# EAGLE schematic Scope (EAGLE 7.1.0)
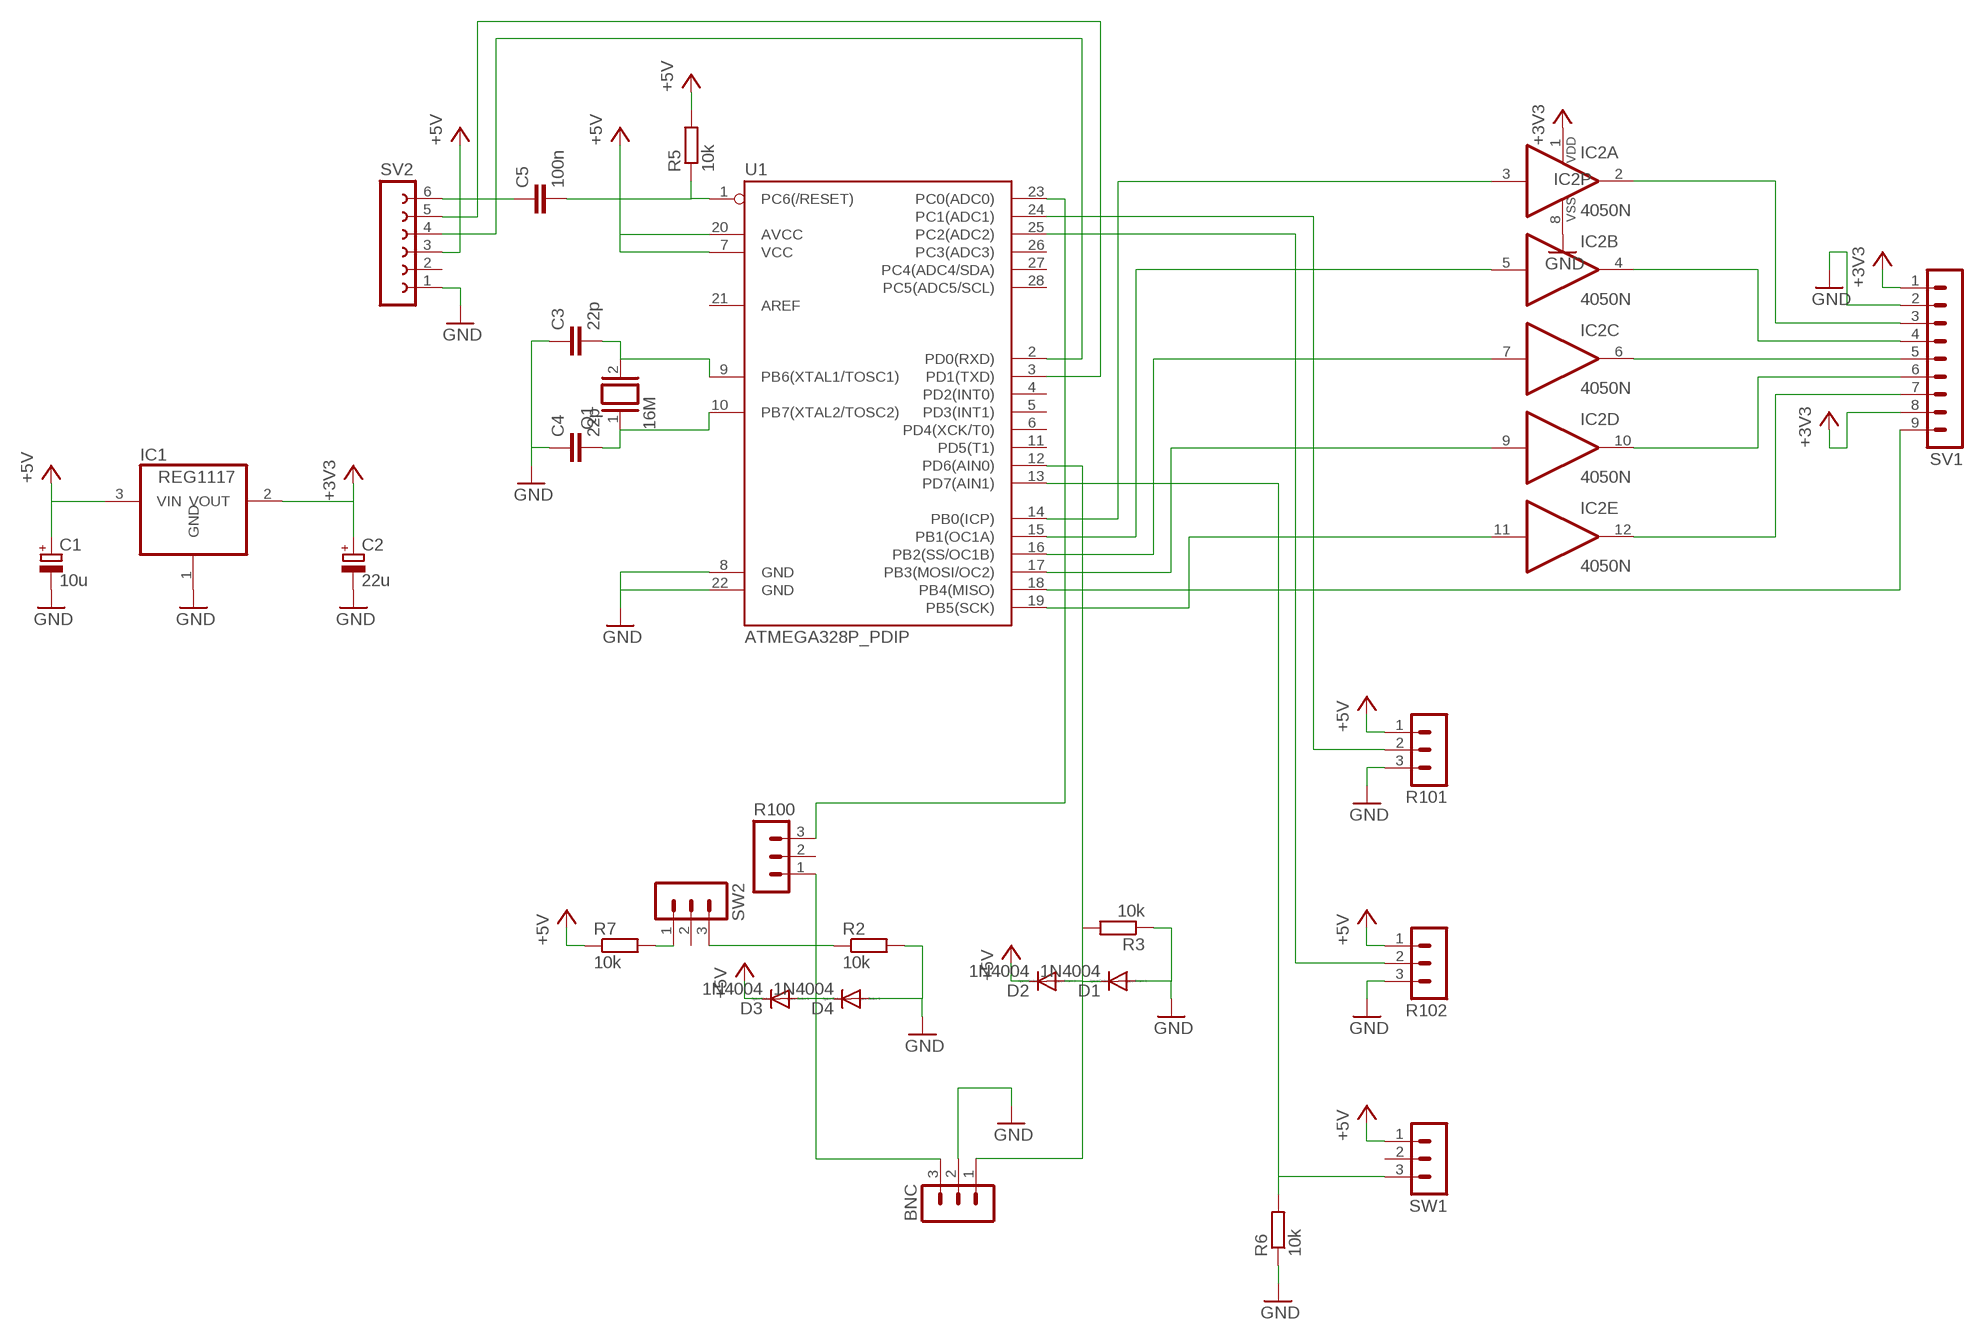
[diagram p0: schematic, sheet 1]

## Parts
BNC  MA03-1  [MA03-1]
C1  10u  CPOL-EUE2,5-6E  [E2,5-6E]
C2  22u  CPOL-EUE2,5-6E  [E2,5-6E]
C3  22p  C-EU050-024X044  [C050-024X044]
C4  22p  C-EU050-024X044  [C050-024X044]
C5  100n  C-EU050-024X044  [C050-024X044]
D1  1N4004  [DO41-10]
D2  1N4004  [DO41-10]
D3  1N4004  [DO41-10]
D4  1N4004  [DO41-10]
IC1  REG1117  [SOT223]
IC2  4050N  [DIL16]
Q1  16M  XTAL/S  [QS]
R2  10k  R-EU_0204/7  [0204/7]
R3  10k  R-EU_0204/7  [0204/7]
R5  10k  R-EU_0204/7  [0204/7]
R6  10k  R-EU_0204/7  [0204/7]
R7  10k  R-EU_0204/7  [0204/7]
R100  MA03-1  [MA03-1]
R101  MA03-1  [MA03-1]
R102  MA03-1  [MA03-1]
SV1  MA09-1  [MA09-1]
SV2  FE06-1  [FE06]
SW1  MA03-1  [MA03-1]
SW2  MA03-1  [MA03-1]
U1  ATMEGA328P_PDIP  [DIL28-3]

## Nets
+3V3: C2.+ IC1.2(VOUT) IC2.1(P:VDD) SV1.1 SV1.8
+5V: D2.C D3.C R7.1 R101.1 R102.1 SW1.1
GND: BNC.2 C1.- C2.- C3.1 C4.1 D1.A D4.A IC1.1(GND) IC2.8(P:VSS) R2.2 R3.1 R6.1 R101.3 R102.3 SV1.2 SV2.1 U1.8(GND) U1.22(GND)
N$1: IC2.11(E:I) U1.19(PB5(SCK))
N$2: IC2.9(D:I) U1.17(PB3(MOSI/OC2))
N$3: IC2.7(C:I) U1.16(PB2(SS/OC1B))
N$4: IC2.5(B:I) U1.15(PB1(OC1A))
N$5: IC2.3(A:I) U1.14(PB0(ICP))
N$6: BNC.1 D1.C D2.A R3.2 U1.12(PD6(AIN0))
N$7: R100.3 U1.23(PC0(ADC0))
N$8: C5.2 R5.1 U1.1(PC6(/RESET))
N$9: C5.1 SV2.6
N$11: IC2.2(A:O) SV1.3
N$12: IC2.4(B:O) SV1.4
N$13: IC2.6(C:O) SV1.5
N$14: BNC.3 D3.A D4.C R2.1 R100.1 SW2.3
N$15: R101.2 U1.24(PC1(ADC1))
N$16: SV1.9 U1.18(PB4(MISO))
N$17: C3.2 Q1.2 U1.9(PB6(XTAL1/TOSC1))
N$18: C4.2 Q1.1 U1.10(PB7(XTAL2/TOSC2))
N$19: IC2.12(E:O) SV1.7
N$20: IC2.10(D:O) SV1.6
N$21: R102.2 U1.25(PC2(ADC2))
N$22: R6.2 SW1.3 U1.13(PD7(AIN1))
N$23: R7.2 SW2.1
N$24: SV2.4 U1.2(PD0(RXD))
N$25: SV2.5 U1.3(PD1(TXD))
VCC: C1.+ IC1.3(VIN) R5.2 SV2.3 U1.7(VCC) U1.20(AVCC) ; supply symbol labelled +5V
Unconnected: IC2.14(F:I) IC2.15(F:O) R100.2 SV2.2 SW1.2 SW2.2 U1.4(PD2(INT0)) U1.5(PD3(INT1)) U1.6(PD4(XCK/T0)) U1.11(PD5(T1)) U1.21(AREF) U1.26(PC3(ADC3)) U1.27(PC4(ADC4/SDA)) U1.28(PC5(ADC5/SCL))

## Library data of the parts
BNC R100-R102 SW1 SW2 = con-lstb:MA03-1: PIN HEADER; OC_FARNELL: unknown; OC_NEWARK: unknown
C1 C2 = rcl:CPOL-EU: POLARIZED CAPACITOR, European symbol
C3-C5 = rcl:C-EU: CAPACITOR, European symbol
D1-D4 = diode:1N4004: DIODE general purpose rectifier, 1 A
IC1 = burr-brown:REG1117: 800mA and 1A Low Dropout (LDO) Positive Regulator 1.8V, 2.5V, 2.85V, 3.3V, 5V, and Adj; MPN: REG1117; OC_FARNELL: 1097566; OC_NEWARK: 14P6981
IC2 = 40xx:4050: Hex non-inverting BUFFER
Q1 = special:XTAL/S: CRYSTAL
R2 R3 R5-R7 = rcl:R-EU_: RESISTOR, European symbol
SV1 = con-lstb:MA09-1: PIN HEADER; OC_FARNELL: unknown; OC_NEWARK: unknown
SV2 = con-lsta:FE06-1: FEMALE HEADER; OC_FARNELL: unknown; OC_NEWARK: unknown
U1 = SparkFun-DigitalIC:ATMEGA328P_PDIP: uC used in the Arduino 32kb flash, 1k EEPROM, 2k SRAM This is the through-hole version of this chip.